# Altium schematic sheet k26_baseboard_sensors.SchDoc: k26 Baseboard Sensors / Motordriver
size A3; DrawnBy: Ch. Vogt; Organization: PBL; DocumentNumber: 1; Revision: r5; SheetNumber: 5
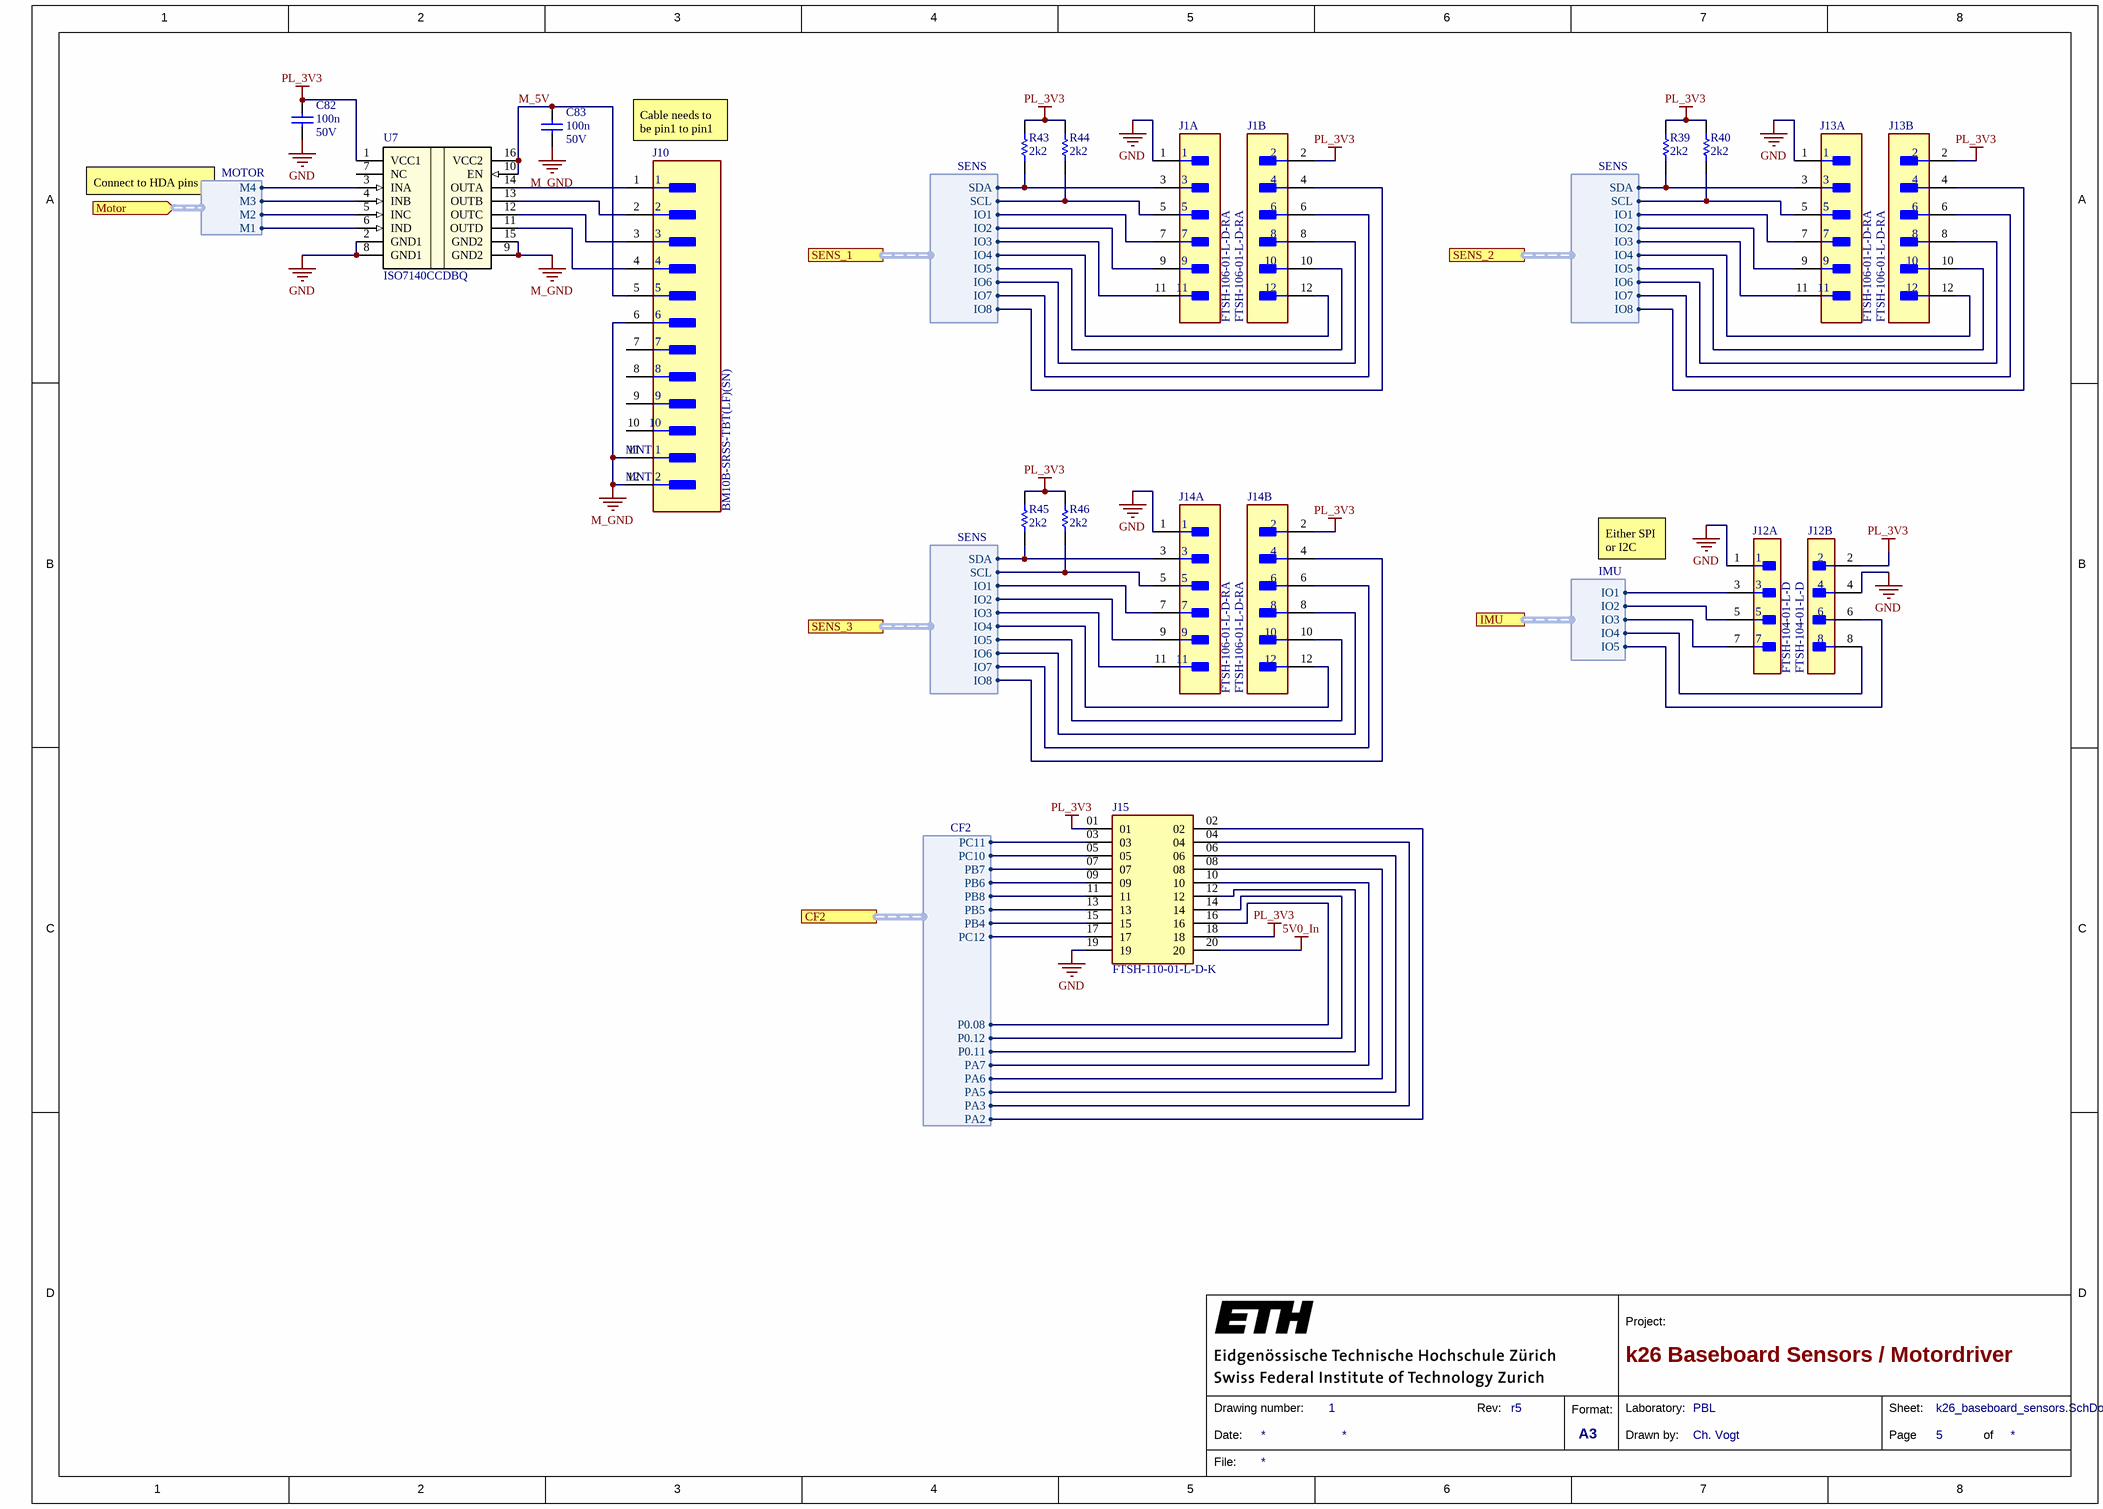
[diagram p0: k26_baseboard_sensors.SchDoc]

## Parts
C82  100n  Rated DC Voltage (URdc): 50V  [CAPC0402]
C83  100n  Rated DC Voltage (URdc): 50V  [CAPC0402]
J1  FTSH-106-01-L-D-RA  [FP-FTSH-106-01-L-D-RA-MFG]  (parts A,B of 2)
J10  BM10B-SRSS-TBT(LF)(SN)  [FP-BM10B-SRSS-TBT_LF_SN-MFG]
J12  FTSH-104-01-L-D  [FP-FTSH-104-01-L-D-MFG]  (parts A,B of 2)
J13  FTSH-106-01-L-D-RA  [FP-FTSH-106-01-L-D-RA-MFG]  (parts A,B of 2)
J14  FTSH-106-01-L-D-RA  [FP-FTSH-106-01-L-D-RA-MFG]  (parts A,B of 2)
J15  FTSH-110-01-L-D-K  [SAMTEC_FTSH-110-01-L-D-K]
R39  2k2  [RES0402]
R40  2k2  [RES0402]
R43  2k2  [RES0402]
R44  2k2  [RES0402]
R45  2k2  [RES0402]
R46  2k2  [RES0402]
U7  ISO7140CCDBQ  [DBQ0016A]

## Ports
CF2 (harness CF2), IMU (harness IMU), Motor (in, harness MOTOR), SENS_1 (harness SENS), SENS_2 (harness SENS), SENS_3 (harness SENS)

## Harnesses
MOTOR: M1, M2, M3, M4
SENS: SCL, SDA, IO1, IO2, IO3, IO4, IO5, IO6, IO7, IO8
IMU: IO1, IO2, IO3, IO4, IO5
CF2: PC11, PC10, PB7, PB6, PB8, PB5, PB4, PC12, P0.08, P0.12, P0.11, PA7, PA6, PA5, PA3, PA2

## Nets
5V0_In: J15.20
GND: C82.1 J1.1 J12.1 J12.4 J13.1 J14.1 J15.19 U7.2(GND1) U7.8(GND1)
M_GND: C83.1 J10.6 J10.11(MNT_1) J10.12(MNT_2) U7.9(GND2) U7.15(GND2)
PL_3V3: C82.2 J1.2 J12.2 J13.2 J14.2 J15.01 J15.18 R39.2 R40.2 R43.2 R44.2 R45.2 R46.2 U7.1(VCC1)
M_5V: C83.2 J10.5 U7.10(EN) U7.16(VCC2)
NetJ1_3: J1.3 R43.1 ; port SENS_1.SDA
NetJ1_4: J1.4 ; port SENS_1.IO8
NetJ1_5: J1.5 R44.1 ; port SENS_1.SCL
NetJ1_6: J1.6 ; port SENS_1.IO7
NetJ1_7: J1.7 ; port SENS_1.IO1
NetJ1_8: J1.8 ; port SENS_1.IO6
NetJ1_9: J1.9 ; port SENS_1.IO2
NetJ1_10: J1.10 ; port SENS_1.IO5
NetJ1_11: J1.11 ; port SENS_1.IO3
NetJ1_12: J1.12 ; port SENS_1.IO4
NetJ10_1: J10.1 U7.14(OUTA)
NetJ10_2: J10.2 U7.13(OUTB)
NetJ10_3: J10.3 U7.12(OUTC)
NetJ10_4: J10.4 U7.11(OUTD)
NetJ12_3: J12.3 ; port IMU.IO1
NetJ12_5: J12.5 ; port IMU.IO2
NetJ12_6: J12.6 ; port IMU.IO5
NetJ12_7: J12.7 ; port IMU.IO3
NetJ12_8: J12.8 ; port IMU.IO4
NetJ13_3: J13.3 R39.1 ; port SENS_2.SDA
NetJ13_4: J13.4 ; port SENS_2.IO8
NetJ13_5: J13.5 R40.1 ; port SENS_2.SCL
NetJ13_6: J13.6 ; port SENS_2.IO7
NetJ13_7: J13.7 ; port SENS_2.IO1
NetJ13_8: J13.8 ; port SENS_2.IO6
NetJ13_9: J13.9 ; port SENS_2.IO2
NetJ13_10: J13.10 ; port SENS_2.IO5
NetJ13_11: J13.11 ; port SENS_2.IO3
NetJ13_12: J13.12 ; port SENS_2.IO4
NetJ14_3: J14.3 R45.1 ; port SENS_3.SDA
NetJ14_4: J14.4 ; port SENS_3.IO8
NetJ14_5: J14.5 R46.1 ; port SENS_3.SCL
NetJ14_6: J14.6 ; port SENS_3.IO7
NetJ14_7: J14.7 ; port SENS_3.IO1
NetJ14_8: J14.8 ; port SENS_3.IO6
NetJ14_9: J14.9 ; port SENS_3.IO2
NetJ14_10: J14.10 ; port SENS_3.IO5
NetJ14_11: J14.11 ; port SENS_3.IO3
NetJ14_12: J14.12 ; port SENS_3.IO4
NetJ15_02: J15.02 ; port CF2.PA2
NetJ15_03: J15.03 ; port CF2.PC11
NetJ15_04: J15.04 ; port CF2.PA3
NetJ15_05: J15.05 ; port CF2.PC10
NetJ15_06: J15.06 ; port CF2.PA5
NetJ15_07: J15.07 ; port CF2.PB7
NetJ15_08: J15.08 ; port CF2.PA6
NetJ15_09: J15.09 ; port CF2.PB6
NetJ15_10: J15.10 ; port CF2.PA7
NetJ15_11: J15.11 ; port CF2.PB8
NetJ15_12: J15.12 ; port CF2.P0.11
NetJ15_13: J15.13 ; port CF2.PB5
NetJ15_14: J15.14 ; port CF2.P0.12
NetJ15_15: J15.15 ; port CF2.PB4
NetJ15_16: J15.16 ; port CF2.P0.08
NetJ15_17: J15.17 ; port CF2.PC12
NetU7_3: U7.3(INA) ; port Motor.M4
NetU7_4: U7.4(INB) ; port Motor.M3
NetU7_5: U7.5(INC) ; port Motor.M2
NetU7_6: U7.6(IND) ; port Motor.M1

Not connected (* = marked no-connect by the designer): J10 7 8 9 10; U7 7(NC)

## Notes on the sheet
- (near J10) Cable needs to be pin1 to pin1
- Connect to HDA pins
- Either SPI or I2C
- 1
- 2
- 3
- 4
- 5
- 6
- 7
- 8
- A
- B
- C
- D
- Project:
- Date:
- Drawing number:
- Rev:
- Format:
- A3
- Drawn by:
- Laboratory:
- Page
- Sheet:
- of
- File:

## Library data of the parts
C82 C83 = cap0402: Ceramic Capacitor, Multilayer, Ceramic, 50V, 10% +Tol, 10% -Tol, X5R, 15% TC, 0.1uF, Surface Mount, 0402; Manufacturer: Yageo; Manufacturer Part Number: CC0402KRX5R9BB104; Capacitance: 100nF; Multilayer: Yes; Supplier 1: Farnell; Supplier Part Number 1: 3366442; RoHS: Yes; Category: Ceramic Capacitors; Stock 1: 180000; Pricing 1: 10000=0.00890, 50000=0.00870 (CHF); Mount: Surface Mount; Number of Pins: 2; Dielectric Material: Ceramic; Package Shape: Rectangular; Size Code: 0402; Terminal Finish: Nickel; Min Operating Temperature: -55°C; Max Operating Temperature: 85°C; JESD-609 Code: e3; Capacitor Type: Ceramic; Negative Tolerance: 10%; Temperature Characteristics Code: X5R; Termination: Wraparound; Positive Tolerance: 10%; Package Style: SMTMeter; Packaging: Tape and Reel; Length: 1mm; Width: 0.5mm; Height: 0.5mm; Reach SVHC Compliant: Yes; RoHS Compliant: Yes; ComponentLink1URL: https://datasheet.ciiva.com:443/pdfs/VipMasterIC/IC/YAGO/YAGO-S-A0006851646/YAGO-S-A0006851646-1.pdf?src-supplier=IHS+Markit; ComponentLink1Description: https://datasheet.ciiva.com:443/pdfs/VipMasterIC/IC/YAGO/YAGO-S-A0006851646/YAGO-S-A0006851646-1.pdf?src-supplier=IHS+Markit; ComponentLink2URL: http://www.yageo.com/documents/recent/UPY-GPHC_X5R_4V-to-50V_25.pdf?src-supplier=Digi-Key; ComponentLink2Description: http://www.yageo.com/documents/recent/UPY-GPHC_X5R_4V-to-50V_25.pdf?src-supplier=Digi-Key; ComponentLink3URL: http://www.yageo.com/documents/recent/UPY-GPHC_X5R_4V-to-50V_23.pdf?src-supplier=Digi-Key; ComponentLink3Description: http://www.yageo.com/documents/recent/UPY-GPHC_X5R_4V-to-50V_23.pdf?src-supplier=Digi-Key
J1 J13 J14 = CMP-00575-08024803-1: FTSH-106-01-L-D-RA Conn, R/A Header, 12Pos, 2Row, 1.27Mm Rohs Compliant: Yes; Manufacturer Lifecycle Status: PRODUCTION; Current Rating: 3.4A; Number of Contacts: 12; Gender: Male; Max Operating Temperature: 125°C; RoHS: Compliant; Orientation: Right Angle; Number of Rows: 2; Length: 7.62mm; Housing Material: Polymer; Housing Color: Black; Min Operating Temperature: -55°C; Radiation Hardening: No; Pitch: 1.27mm; REACH SVHC: No SVHC; NexarPartId: 8024803; Lifecycle Status: Production; Depth: 8.1mm; Termination: Solder; Height: 3.56mm; Contact Plating: Gold; Contact Material: Bronze, Gold, Nickel
J10 = CMP-17439-000586-1: CONN HEADER SMD 10POS 1MM; Number of Positions: 10; Lead Free: Lead Free; Pitch: 1mm; Termination: Crimp
J12 = CMP-02766-001408-1: CONN HEADER VERT 8POS 1.27MM; Gender: Male; Number of Contacts: 8; RoHS Compliant: Yes; Radiation Hardening: No; REACH SVHC: No SVHC; Contact Plating: Gold; Orientation: Straight; Housing Material: Polymer; Max Operating Temperature: 125°C; Pitch: 1.27mm; Min Operating Temperature: -55°C; Termination: Solder; Number of Rows: 2; Depth: 3.43mm; Contact Material: Bronze; Series: FTSH; Housing Color: Black; Packaging: Bulk; Length: 5.08mm
R39 R40 R43-R46 = res0402: Fixed Resistor, Metal Glaze/thick Film, 0.063W, 2200ohm, 50V, 1% +/-Tol, 100ppm/Cel, Surface Mount, 0402; Manufacturer: Vishay; Manufacturer Part Number: CRCW04022K20FKED; Power: 63mW; Value: 2.2kR; Temperature Coefficient: 100ppm/°C; Rated Temperature: 70°C; Package Height: 0.35mm; Package Length: 1mm; Package Width: 0.5mm; Reference Standard: AEC-Q200; Supplier: Farnell; Supplier Part Number: 2121643; RoHS: Yes; Category: Chip SMD Resistors; Stock: 30000; Pricing: 10000=0.00400, 50000=0.00390, 100000=0.00380 (CHF); Mounting Technology: Surface Mount; Pins: 2; Case/Package: 0402; Package Shape: Rectangular; Terminal Finish: Nickel; Min Operating Temperature: -55°C; Max Operating Temperature: 155°C; Tolerance: 1%; Resistor Type: FIXED RESISTOR; Termination: Wraparound; Packaging: Tape and Reel; Technology: METAL GLAZE/THICK FILM; Working Voltage: 50V; Package Style: SMTMeter; Construction: Chip; JESD-609 Code: e3; RoHS Compliant: Yes; Reach SVHC Compliant: Yes; ComponentLink1URL: https://datasheet.ciiva.com:443/pdfs/VipMasterIC/IC/VISH/VISH-S-A0007266705/VISH-S-A0007266705-1.pdf?src-supplier=IHS+Markit; ComponentLink1Description: https://datasheet.ciiva.com:443/pdfs/VipMasterIC/IC/VISH/VISH-S-A0007266705/VISH-S-A0007266705-1.pdf?src-supplier=IHS+Markit; ComponentLink2URL: https://datasheet.ciiva.com/11811/0900766b80d98824-11811709.pdf?src-supplier=Rs; ComponentLink2Description: https://datasheet.ciiva.com/11811/0900766b80d98824-11811709.pdf?src-supplier=Rs; ComponentLink3URL: https://datasheet.ciiva.com/3256/dcrcwe3-3256341.pdf?src-supplier=Avnet; ComponentLink3Description: https://datasheet.ciiva.com/3256/dcrcwe3-3256341.pdf?src-supplier=Avnet; ComponentLink4URL: https://datasheet.ciiva.com/16209/dcrcwe3-16209157.pdf?src-supplier=Future+Electronics; ComponentLink4Description: https://datasheet.ciiva.com/16209/dcrcwe3-16209157.pdf?src-supplier=Future+Electronics; ComponentLink5URL: https://datasheet.ciiva.com/2464/dcrcwe3-2464486.pdf?src-supplier=Digi-Key; ComponentLink5Description: https://datasheet.ciiva.com/2464/dcrcwe3-2464486.pdf?src-supplier=Digi-Key; ComponentLink6URL: https://datasheet.ciiva.com/2464/dcrcwe3-2464487.pdf?src-supplier=Digi-Key; ComponentLink6Description: https://datasheet.ciiva.com/2464/dcrcwe3-2464487.pdf?src-supplier=Digi-Key; ComponentLink7URL: https://datasheet.ciiva.com/2464/dcrcwe3-2464488.pdf?src-supplier=Digi-Key; ComponentLink7Description: https://datasheet.ciiva.com/2464/dcrcwe3-2464488.pdf?src-supplier=Digi-Key; ComponentLink8URL: https://datasheet.ciiva.com/5541/dcrcwe3-109170-5541416.pdf?src-supplier=Mouser; ComponentLink8Description: https://datasheet.ciiva.com/5541/dcrcwe3-109170-5541416.pdf?src-supplier=Mouser; ComponentLink9URL: https://datasheet.ciiva.com/26316/fld-crcw-e3-data-en-26316650.pdf?src-supplier=Distrelec; ComponentLink9Description: https://datasheet.ciiva.com/26316/fld-crcw-e3-data-en-26316650.pdf?src-supplier=Distrelec; ComponentLink10URL: https://datasheet.ciiva.com/7777/1697337-7777227.pdf?src-supplier=Element14; ComponentLink10Description: https://datasheet.ciiva.com/7777/1697337-7777227.pdf?src-supplier=Element14; ComponentLink11URL: https://datasheet.ciiva.com/7777/1697337-7777228.pdf?src-supplier=Element14; ComponentLink11Description: https://datasheet.ciiva.com/7777/1697337-7777228.pdf?src-supplier=Element14; ComponentLink12URL: https://datasheet.ciiva.com/16778/70201119-16778943.pdf?src-supplier=Allied+Electronics; ComponentLink12Description: https://datasheet.ciiva.com/16778/70201119-16778943.pdf?src-supplier=Allied+Electronics
U7 = ISO7140CCDBQR: No Description Available; Mfr_Name: Texas Instruments; CompType: IC; TYPE: TYPE; RefDes: RefDes; PartNumber: ISO7140CCDBQ; PackageReference: DBQ0016A; MountType: SMT; RoHS: Y; Manufacturer: Texas Instruments
J15 = FTSH-110-01-L-D-K: Price: None; MP: FTSH-110-01-L-D-K; Value: *; Availability: Unavailable; Package: None